# EAGLE schematic Schematic Proiect PM Robotic Hand Anastasia Steliana Stanciu 334CC (EAGLE 9.7.0)
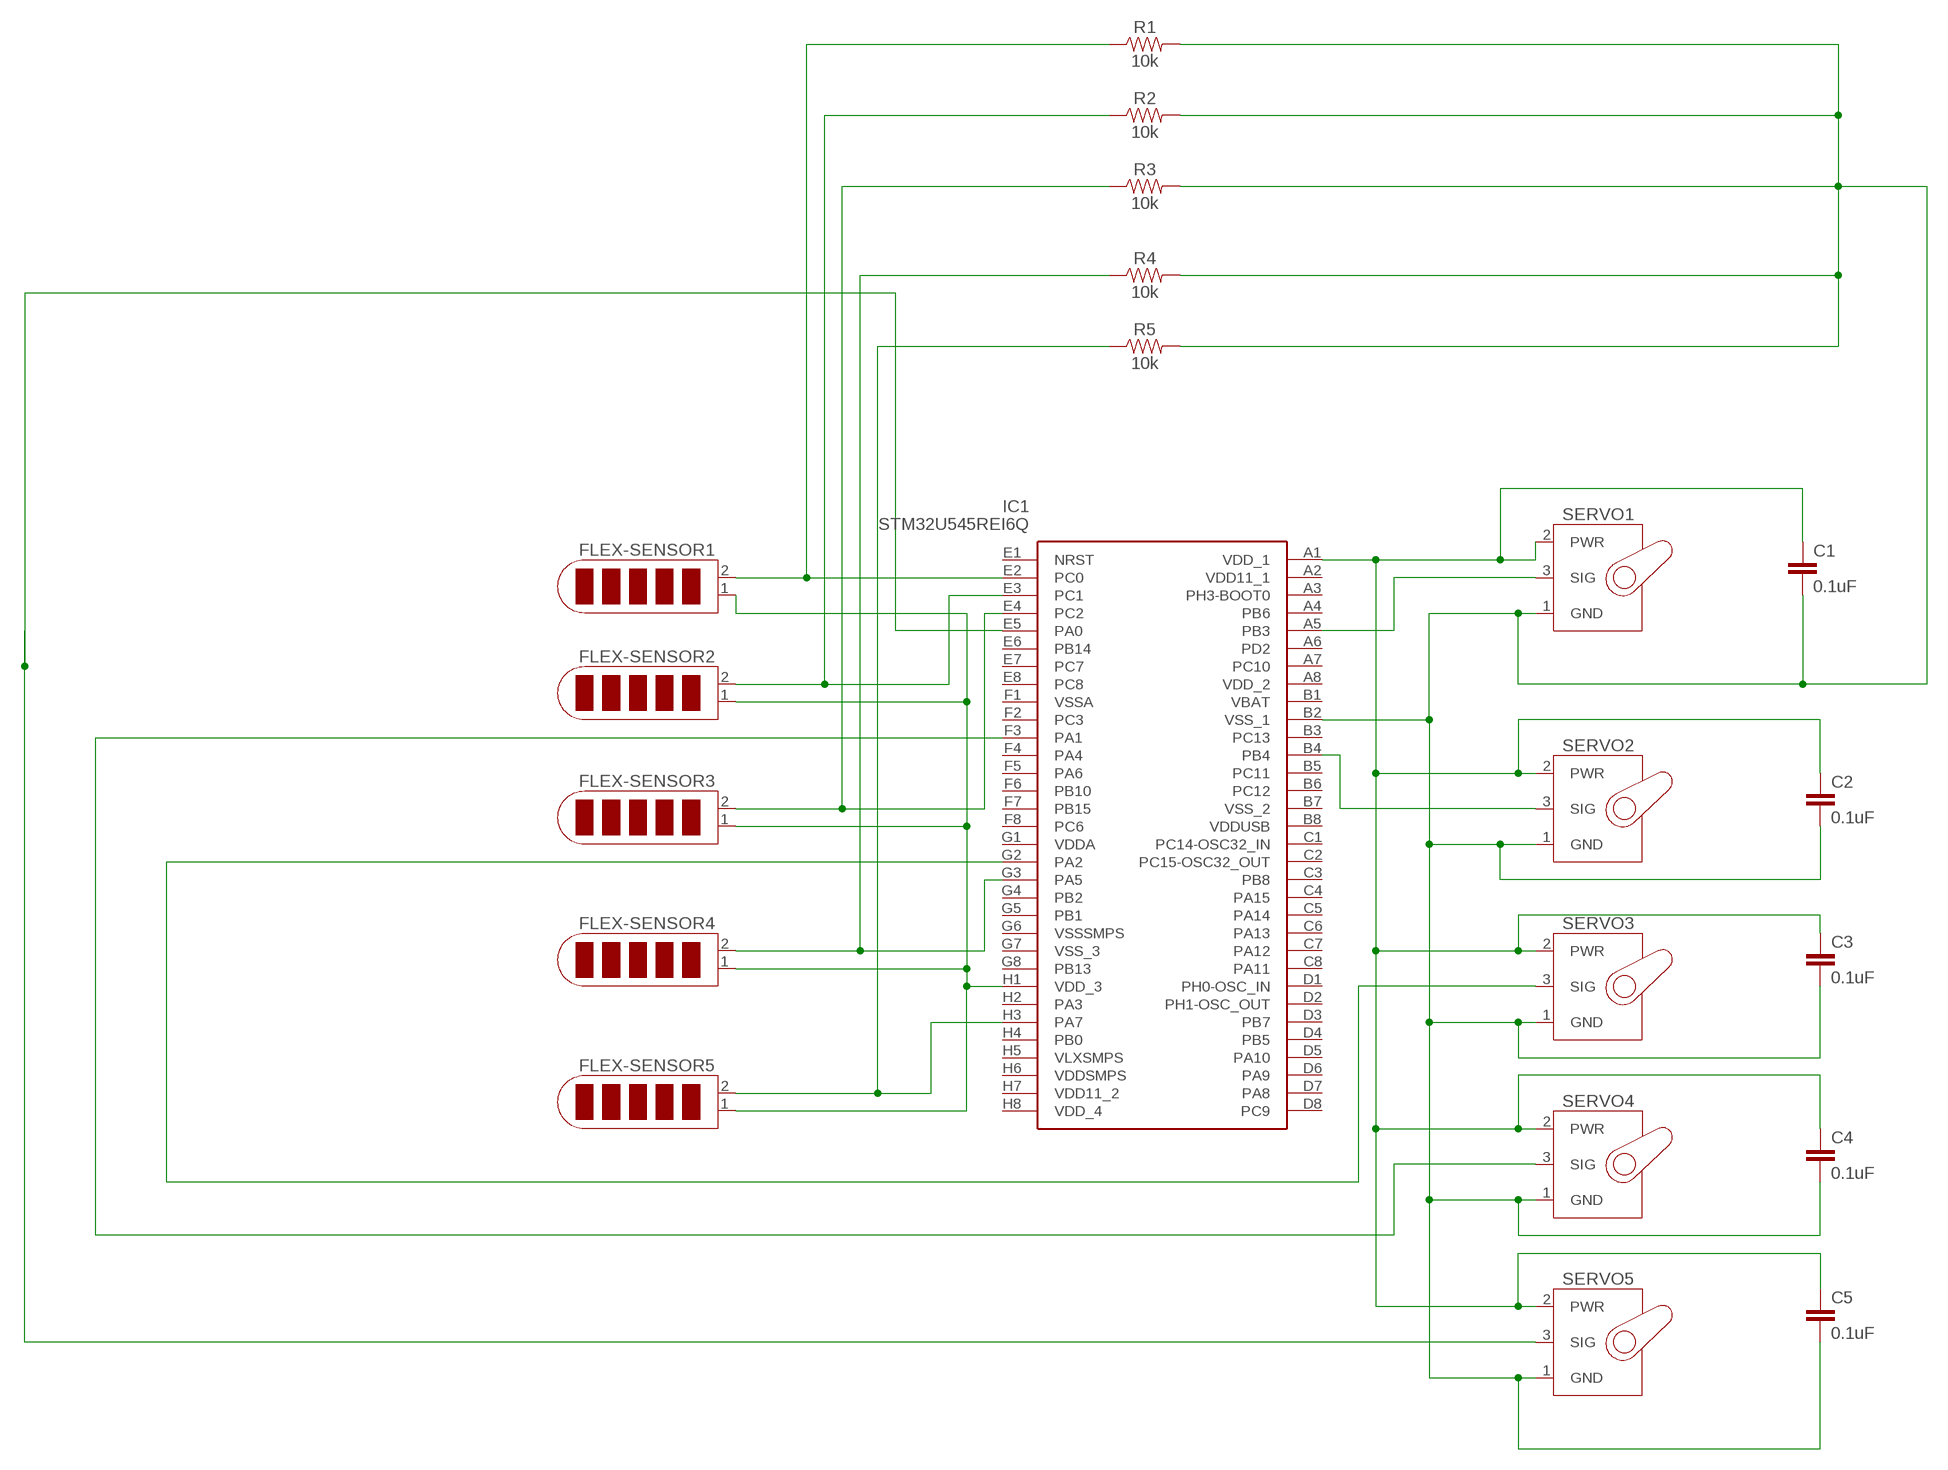
[diagram p0: schematic, sheet 1]

## Parts
C1  0.1uF  0.1UF-0402-16V-10%  [0402]
C2  0.1uF  0.1UF-0402-16V-10%  [0402]
C3  0.1uF  0.1UF-0402-16V-10%  [0402]
C4  0.1uF  0.1UF-0402-16V-10%  [0402]
C5  0.1uF  0.1UF-0402-16V-10%  [0402]
IC1  STM32U545REI6Q  [BGA64C50P8X8_500X500X60]
R1  10k  10KOHM-HORIZ-1/4W-1%  [AXIAL-0.3]
R2  10k  10KOHM-HORIZ-1/4W-1%  [AXIAL-0.3]
R3  10k  10KOHM-HORIZ-1/4W-1%  [AXIAL-0.3]
R4  10k  10KOHM-HORIZ-1/4W-1%  [AXIAL-0.3]
R5  10k  10KOHM-HORIZ-1/4W-1%  [AXIAL-0.3]
SERVO1  SERVOSG90-HDR  [1X03]
SERVO2  SERVOSG90-HDR  [1X03]
SERVO3  SERVOSG90-HDR  [1X03]
SERVO4  SERVOSG90-HDR  [1X03]
SERVO5  SERVOSG90-HDR  [1X03]
U$6  FLEX-SENSOR2  FLEX-SENSOR  [1X02]
U$7  FLEX-SENSOR3  FLEX-SENSOR  [1X02]
U$8  FLEX-SENSOR1  FLEX-SENSOR  [1X02]
U$9  FLEX-SENSOR4  FLEX-SENSOR  [1X02]
U$10  FLEX-SENSOR5  FLEX-SENSOR  [1X02]

## Nets
N$2: C1.1 C2.1 C3.1 C4.1 C5.1 IC1.A1(VDD_1) SERVO1.2(PWR) SERVO2.2(PWR) SERVO3.2(PWR) SERVO4.2(PWR) SERVO5.2(PWR)
N$3: IC1.A5(PB3) SERVO1.3(SIG)
N$4: IC1.B4 SERVO2.3(SIG)
N$5: IC1.G2(PA2) SERVO3.3(SIG)
N$6: IC1.F3(PA1) SERVO4.3(SIG)
N$7: IC1.E5(PA0) SERVO5.3(SIG)
N$8: IC1.E2(PC0) R1.P$1 U$8.2
N$9: IC1.H1(VDD_3) U$6.1 U$7.1 U$8.1 U$9.1 U$10.1
N$10: IC1.E3(PC1) R2.P$1 U$6.2
N$11: IC1.E4(PC2) R3.P$1 U$7.2
N$12: IC1.G3(PA5) R4.P$1 U$9.2
N$13: IC1.H3(PA7) R5.P$1 U$10.2
N$14: C1.2 C2.2 C3.2 C4.2 C5.2 IC1.B2(VSS_1) R1.P$2 R2.P$2 R3.P$2 R4.P$2 R5.P$2 SERVO1.1(GND) SERVO2.1(GND) SERVO3.1(GND) SERVO4.1(GND) SERVO5.1(GND)
Unconnected: IC1.A2(VDD11_1) IC1.A3(PH3-BOOT0) IC1.A4(PB6) IC1.A6(PD2) IC1.A7(PC10) IC1.A8(VDD_2) IC1.B1(VBAT) IC1.B3(PC13) IC1.B5(PC11) IC1.B6(PC12) IC1.B7(VSS_2) IC1.B8(VDDUSB) IC1.C1(PC14-OSC32_IN) IC1.C2(PC15-OSC32_OUT) IC1.C3(PB8) IC1.C4(PA15) IC1.C5(PA14) IC1.C6(PA13) IC1.C7(PA12) IC1.C8(PA11) IC1.D1(PH0-OSC_IN) IC1.D2(PH1-OSC_OUT) IC1.D3(PB7) IC1.D4(PB5) IC1.D5(PA10) IC1.D6(PA9) IC1.D7(PA8) IC1.D8(PC9) IC1.E1(NRST) IC1.E6(PB14) IC1.E7(PC7) IC1.E8(PC8) IC1.F1(VSSA) IC1.F2(PC3) IC1.F4(PA4) IC1.F5(PA6) IC1.F6(PB10) IC1.F7(PB15) IC1.F8(PC6) IC1.G1(VDDA) IC1.G4(PB2) IC1.G5(PB1) IC1.G6(VSSSMPS) IC1.G7(VSS_3) IC1.G8(PB13) IC1.H2(PA3) IC1.H4(PB0) IC1.H5(VLXSMPS) IC1.H6(VDDSMPS) IC1.H7(VDD11_2) IC1.H8(VDD_4)

## Library data of the parts
C1-C5 = SparkFun-Capacitors:0.1UF: 0.1µF ceramic capacitors A capacitor is a passive two-terminal electrical component used to store electrical energy temporarily in an electric field.
IC1 = Lib STM32U545REQ:STM32U545REI6Q: Ultra-low-power Arm Cortex-M33 MCU+TrustZone+FPU, 240 DMPIS, 512 KB flash memory, 274 KB SRAM, crypto Source: Datasheet <https://www.st.com/resource/en/datasheet/stm32u545ce.pdf>
R1-R5 = SparkFun-Resistors:10KOHM: 10kΩ resistor A resistor is a passive two-terminal electrical component that implements electrical resistance as a circuit element. Resistors act to reduce current flow, and, at the same time, act to lower voltage levels within circuits. - Wikipedia
SERVO1-SERVO5 = Tinkercad:SERVO
U$6-U$10 = Tinkercad:FLEX-SENSOR